# Altium schematic sheet 02 - POWER.SchDoc
size 420 x 297 mm; Organization: ToyBuilder Labs; Address1: 2736 E Walnut St; Address2: Pasadena, California 91107; Address4: +1 (626) 808-4010; DocumentNumber: 3; SheetNumber: 3; SheetTotal: 4
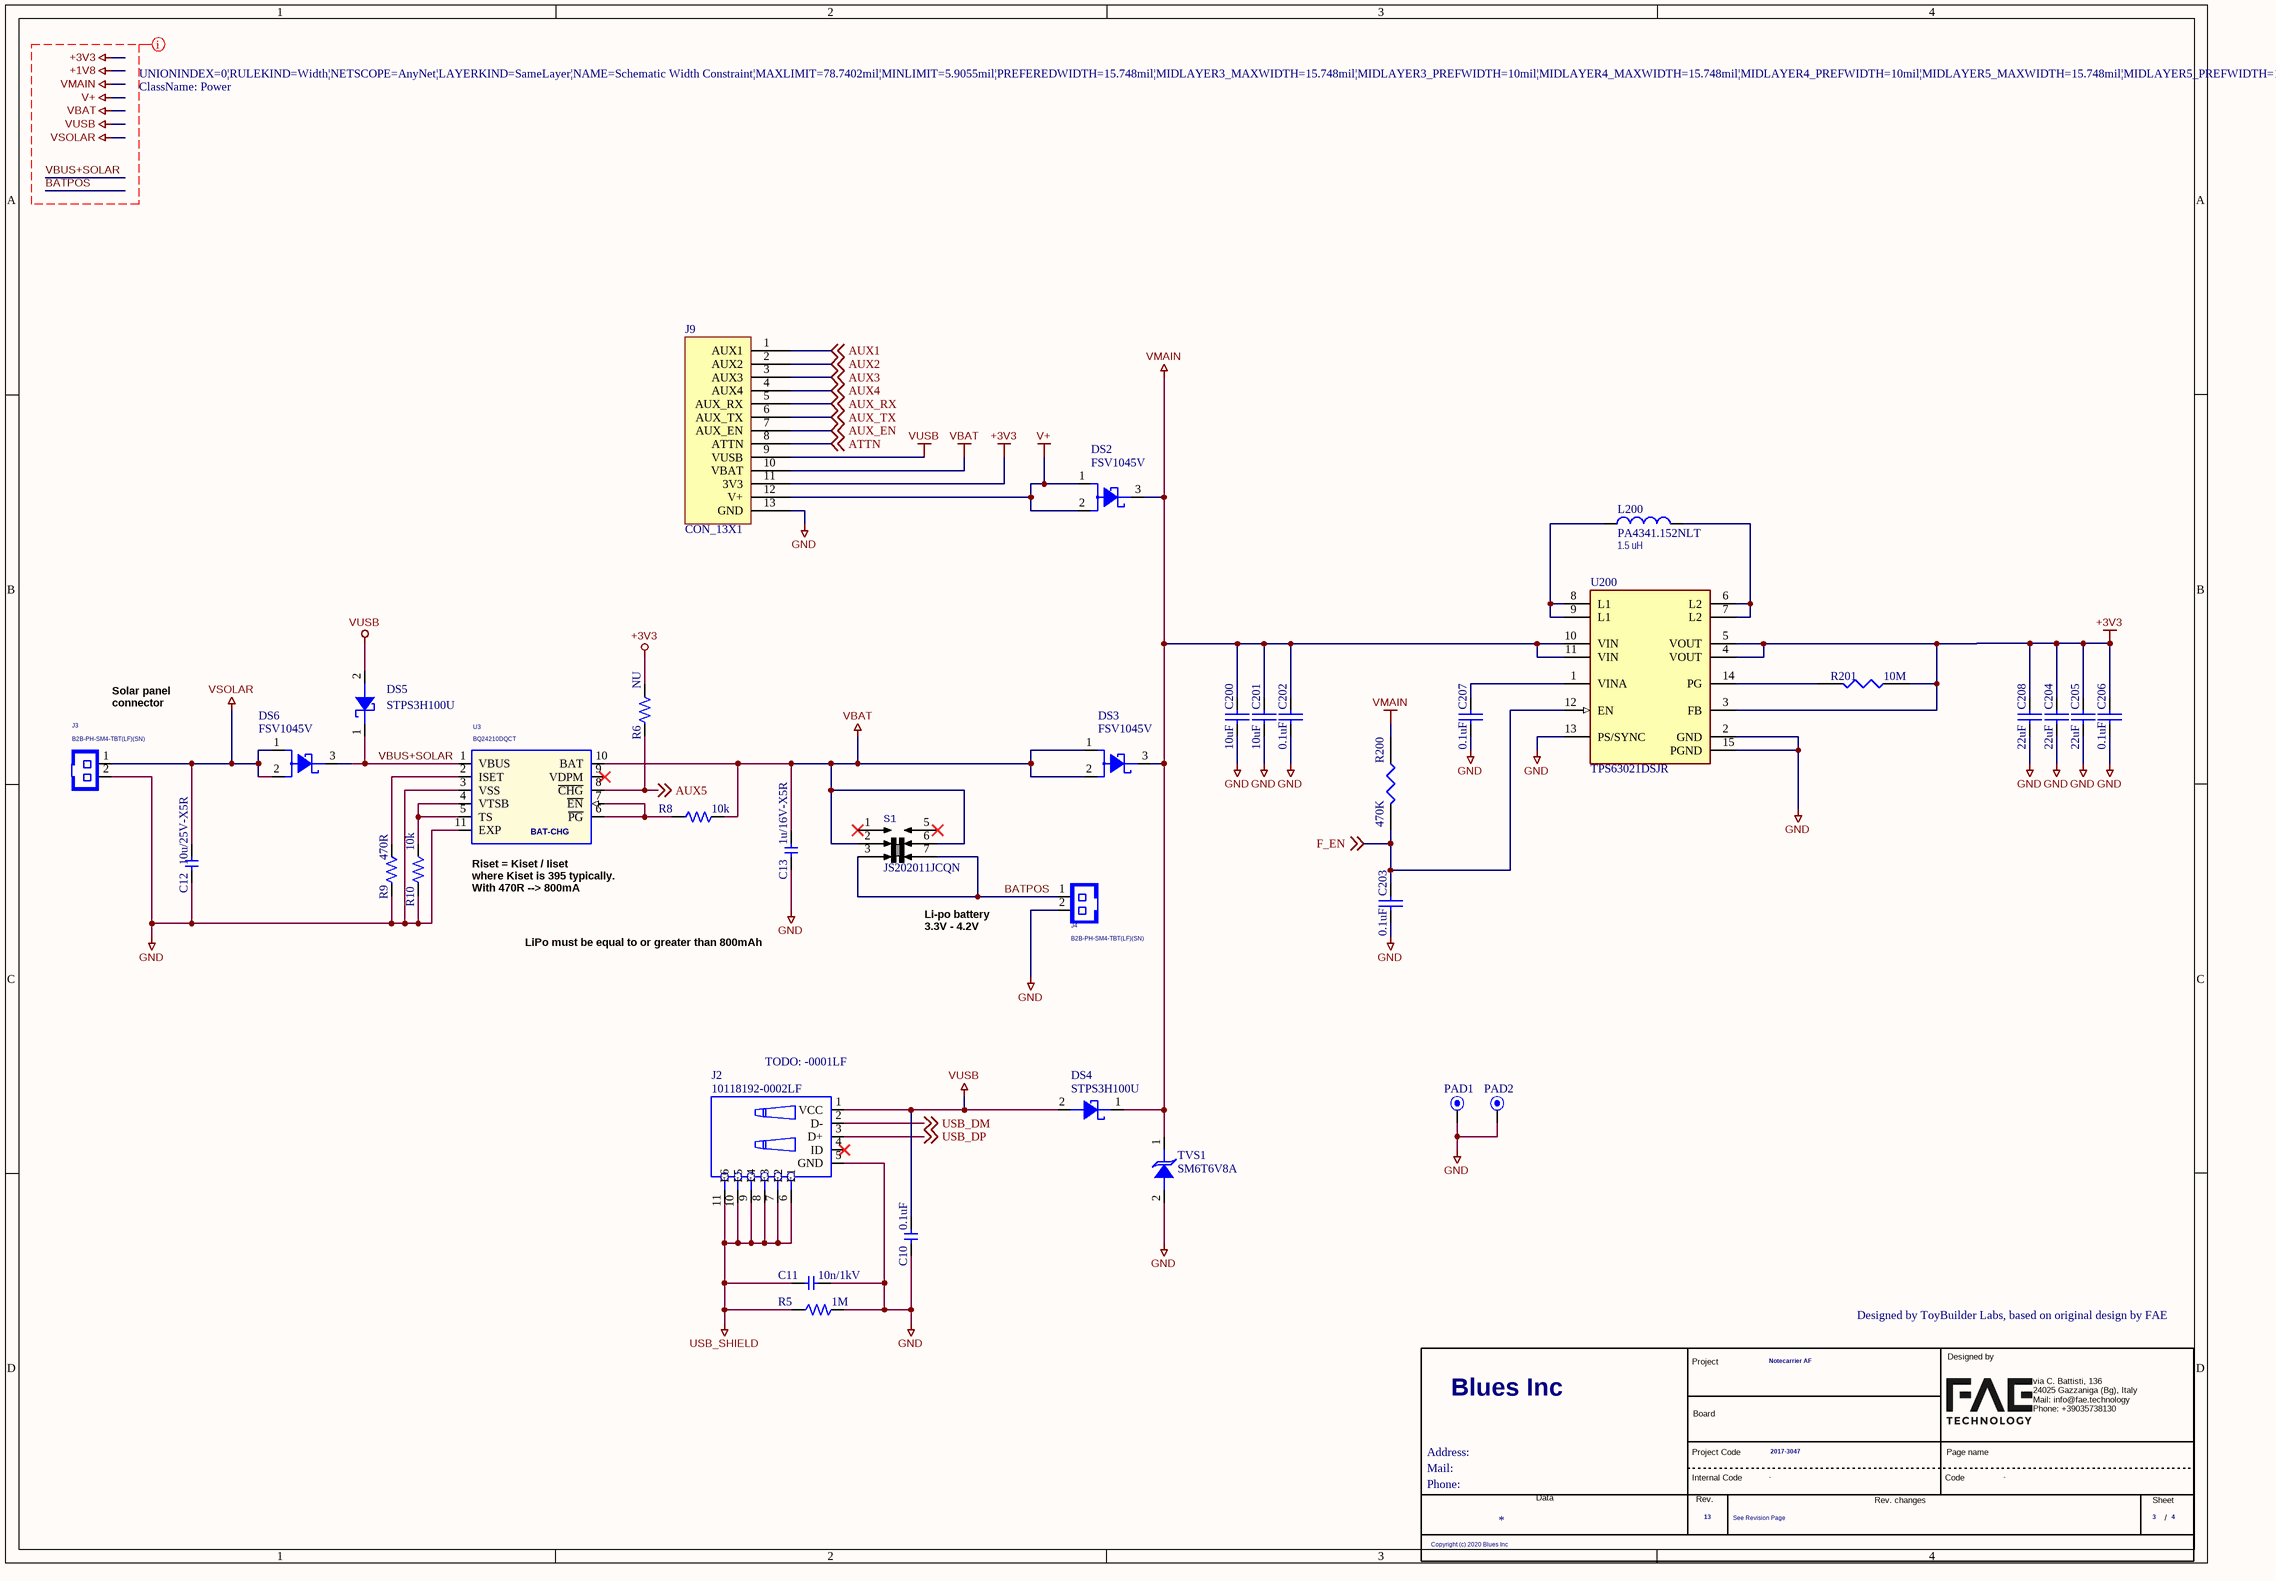
[diagram p0: 02 - POWER.SchDoc]

## Parts
*  Address: Address:  Copyright: Copyright (c) 2020 Blues Inc  CustomerName: Blues Inc  DocumentoRev: See Revision Page  Mail: Mail:  Nome Progetto: Notecarrier AF  Page Count: 4  Page Number: 3  Phone: Phone:  Project Code: 2017-3047  Revision: 13  (hidden comment: MyBlues)  (graphical)
C10  0.1uF  [CS-C-0402]
C11  10n/1kV  [CS-C-1206]
C12  10u/25V-X5R  [CS-C-1206]
C13  1u/16V-X5R  [CS-C-0402]
C200  10uF  [0805_C]
C201  10uF  [0805_C]
C202  0.1uF  [CS-C-0402]
C203  0.1uF  [CS-C-0402]
C204  22uF  [0805_C]
C205  22uF  [0805_C]
C206  0.1uF  [CS-C-0402]
C207  0.1uF  [CS-C-0402]
C208  22uF  [0805_C]
DS2  FSV1045V  [TO277-3]
DS3  FSV1045V  [TO277-3]
DS4  STPS3H100U  [SMB]
DS5  STPS3H100U  [SMB]
DS6  FSV1045V  [TO277-3]
J2  10118192-0002LF  [J-5-0065-FOS-MICROUSB10118192]
J3  B2B-PH-SM4-TBT(LF)(SN)  [J-2-0200-MDS-B2B-PH-SM4]
J4  B2B-PH-SM4-TBT(LF)(SN)  [J-2-0200-MDS-B2B-PH-SM4]
J9  CON_13X1  [WE13S - 2.54]  (no BOM)
L200  PA4341.152NLT  Inductance: 1.5 uH  [PULSE PA4341.XXXNLT]
PAD1  TPS  [PAD-THT-CAS-0100]  (value not drawn)  (no BOM)
PAD2  TPS  [PAD-THT-CAS-0100]  (value not drawn)  (no BOM)
R5  1M  [RS-1206]
R6  NU  [RS-0402]
R8  10k  [RS-0402]
R9  470R  [RS-0402]
R10  10k  [RS-0402]
R200  470K  [RS-0402]
R201  10M  [RS-0402]
S1  JS202011JCQN  [CK_JS202011JCQN]
TVS1  SM6T6V8A  [SMB]
U3  BQ24210DQCT  [WSON10-EXP]
U200  TPS63021DSJR  [FP-DSJ0014A-MFG]

## Nets
+3V3: C204.1 C205.1 C206.1 C208.1 J9.11(3V3) R6.2 R201.1 U200.3(FB) U200.4(VOUT) U200.5(VOUT)
GND: C10.2 C11.2 C12.2 C13.2 C200.2 C201.2 C202.2 C203.2 C204.2 C205.2 C206.2 C207.2 C208.2 J2.5(GND) J3.2 J4.2 J9.13(GND) PAD1.1 PAD2.1 R5.2 R9.1 R10.1 TVS1.2(A) U3.3(VSS) U3.11(EXP) U200.2(GND) U200.13(PS/SYNC) U200.15(PGND)
USB_SHIELD: C11.1 J2.6(E1) J2.7(E2) J2.8(E3) J2.9(E4) J2.10(E5) J2.11(E6) R5.1
V+: DS2.1(A1) DS2.2(A2) J9.12(V+)
VBAT: C13.1 DS3.1(A1) DS3.2(A2) J9.10(VBAT) R8.2 S1.2 S1.6 U3.10(BAT)
VMAIN: C200.1 C201.1 C202.1 DS2.3(C) DS3.3(C) DS4.1(C) R200.1 TVS1.1(C) U200.10(VIN) U200.11(VIN)
VSOLAR: C12.1 DS6.1(A1) DS6.2(A2) J3.1
VUSB: C10.1 DS4.2(A) DS5.2(A) J2.1(VCC) J9.9(VUSB)
ATTN: J9.8(ATTN) ; off-sheet ATTN
AUX1: J9.1(AUX1) ; off-sheet AUX1
AUX2: J9.2(AUX2) ; off-sheet AUX2
AUX3: J9.3(AUX3) ; off-sheet AUX3
AUX4: J9.4(AUX4) ; off-sheet AUX4
AUX5: R6.1 U3.8(~{CHG}) ; off-sheet AUX5
AUX_EN: J9.7(AUX_EN) ; off-sheet AUX_EN
AUX_RX: J9.5(AUX_RX) ; off-sheet AUX_RX
AUX_TX: J9.6(AUX_TX) ; off-sheet AUX_TX
BATPOS: J4.1 S1.3 S1.7
F_EN: C203.1 R200.2 U200.12(EN) ; off-sheet F_EN
USB_DM: J2.2(D-) ; off-sheet USB_DM
USB_DP: J2.3(D+) ; off-sheet USB_DP
VBUS+SOLAR: DS5.1(C) DS6.3(C) U3.1(VBUS)
NetC207_1: C207.1 U200.1(VINA)
NetL200_1: L200.1 U200.8(L1) U200.9(L1)
NetL200_2: L200.2 U200.6(L2) U200.7(L2)
NetR8_1: R8.1 U3.6(~{PG}) U3.7(~{EN})
NetR9_2: R9.2 U3.2(ISET)
NetR10_2: R10.2 U3.4(VTSB) U3.5(TS)
NetR201_2: R201.2 U200.14(PG)

Not connected (* = marked no-connect by the designer): J2 4(ID)*; S1 1* 5*; U3 9(VDPM)*

## Layout directives
rule Width Constraint [Pref Width = 0.4mm    Min Width = 0.15mm    Max Width = 2mm]; net class Power: +1V8, +3V3, BATPOS, V+, VBAT, VBUS+SOLAR, VMAIN, VSOLAR, VUSB

## Notes on the sheet
- (near J3) Solar panel
  connector
- Riset = Kiset / Iiset
  where Kiset is 395 typically.
  With 470R --> 800mA
- LiPo must be equal to or greater than 800mAh
- Li-po battery
  3.3V - 4.2V
- (near J2) TODO: -0001LF
- Designed by ToyBuilder Labs, based on original design by FAE
- Title
- Size:
- Date:
- B
- Number:
- Time:
- Revision:
- Sheet
- of
- File:
- (in symbol BAT-CHARGE - BQ24210DQCT) BAT-CHG
- (in symbol MyBlues) Designed by; Project; Board; via C. Battisti, 136 / 24025 Gazzaniga (Bg), Italy / Mail: info@fae.technology / Phone: +39035738130; Project Code; Page name; Internal Code; Code; Data; Rev.; Rev. changes; Sheet; /

## Library data of the parts
C10 = CS-C-0402-100n/16V: CHIP CAP.CER. 100nF 16V 10% X7R 0402; MFR: Yageo; Database: 22452; Famiglia: CONDENSATORE; Modello: CERAMICO; Pkg Type: SMD; D: Multilayer Ceramic Capacitors MLCC - SMD/SMT 0.1 uF 16V 10% Ceramic Capacitor; PN: CC0402KPX5R7BB104; Caratteristiche: X7R; Distributor: FAE; Price Distributor Cad: 0,0021; PCB Footprint: CS-C-0402
C11 = CS-C-1206-10n/1kV: CHIP CAP.CER. 10nF 1000V 10% X7R 1206; Database: 28470; Famiglia: CONDENSATORE; Modello: CERAMICO; Pkg Type: SMD; Caratteristiche: X7R; Distributor: FAE; Price Distributor Cad: 0,035; PCB Footprint: CS-C-1206
C12 = CS-C-1206-10u/25V-X5R: CHIP CAP.CER. 10uF 25V X5R 10% 1206; Pkg Type: SMD; Modello: CERAMICO; Famiglia: CONDENSATORE; Database: 21513; Price Distributor Cad: 0,0195; Distributor: FAE; Caratteristiche: X5R; PCB Footprint: CS-C-1206
C13 = CS-C-0402-1u/16-X5R: CHIP CAP.CER. 1uF 16V 10% X5R 0402; Pkg Type: SMD; Modello: CERAMICO; Famiglia: CONDENSATORE; Database: 37485; Price Distributor Cad: 0,0253; Distributor: FAE; Caratteristiche: X5R; PCB Footprint: CS-C-0402
C200 = CAP: CHIP CAP.CER. 10uF 16V 10% X7R 0805; MFR: TDK; PN: C2012JB1C106K085AC; D: Multilayer Ceramic Capacitors MLCC - SMD/SMT 0805 16V 10uF JB 10% T: 0.85mm
C201 = CAP: CHIP CAP.CER. 10uF 16V 10% X7R 0805; MFR: TDK; D: Multilayer Ceramic Capacitors MLCC - SMD/SMT 0805 16V 10uF JB 10% T: 0.85mm; PN: C2012JB1C106K085AC
C202 = CAP: CHIP CAP.CER. 100nF 16V 10% X7R 0402; MFR: Yageo; D: Multilayer Ceramic Capacitors MLCC - SMD/SMT 0.1 uF 16V 10% Ceramic Capacitor; PN: CC0402KPX5R7BB104
C203 C206 C207 = CAP: CHIP CAP.CER. 100nF 16V 10% X7R 0402; MFR: Yageo; PN: CC0402KPX5R7BB104; D: Multilayer Ceramic Capacitors MLCC - SMD/SMT 0.1 uF 16V 10% Ceramic Capacitor
C204 C208 = CAP: CHIP CAP.CER. 22uF 16V 10% X7R 0805; MFR: TDK; D: Multilayer Ceramic Capacitors MLCC - SMD/SMT 0805 16V 22uF JB 10% T: 0.85mm; PN: C2012JB1C226K085AC
C205 = CAP: CHIP CAP.CER. 22uF 16V 10% X7R 0805; MFR: TDK; PN: C2012JB1C226K085AC; D: Multilayer Ceramic Capacitors MLCC - SMD/SMT 0805 16V 22uF JB 10% T: 0.85mm
DS2 DS3 DS6 = SCHOTTKY - FSV1045V - 10A/45V: DIODO SCHOTTKY 10A 45V FSV1045V TO277-3 SMT; Database: 42269; Pkg Type: SMD; Temp Range: -55°..+150°; Caratteristiche: 10A/45V; Distributor: FAE; Famiglia: DIODO; Modello: SCHOTTKY; Price Distributor Cad: 0,629; MPN: FSV1045V; PCB Footprint: TO277-3
DS4 = SCHOTTKY-STPS3H100U - 3A/100V: DIODO SCHOTTKY 3A 100V STPS3H100U SMB SMT; Database: 40665; Pkg Type: SMD; ROOM: USB; Caratteristiche: 3A/100V; Distributor: FAE; Famiglia: DIODO; Modello: SCHOTTKY; Price Distributor Cad: 0,336; MPN: STPS3H100U; PCB Footprint: SMB
DS5 = SCHOTTKY-STPS3H100U - 3A/100V: DIODO SCHOTTKY 3A 100V STPS3H100U SMB SMT; Database: 40665; Pkg Type: SMD; ROOM: SOLAR BATTERY CHARGER; Caratteristiche: 3A/100V; Distributor: FAE; Famiglia: DIODO; Modello: SCHOTTKY; Price Distributor Cad: 0,336; MPN: STPS3H100U; PCB Footprint: SMB
J2 = USB - uUSB-B-10118192-0002LF: CONN. USB F/90° TIPO MICRO-B C.S. 10118192-0002LF FCI SMT; Famiglia: CONNETTORE; Modello: MICROUSB; Note: Full SMD, no FLANGE; Pkg Type: SMD; Temp Range: -30°..+80°; PCB Footprint: J-5-0065-FOS-USB10118192-NOF; Distributor: D-609-5379-1-ND; MPN: 10118192-0002LF; Price Distributor Cad: 0,42
J3 J4 = PH - J-2-0200-MDS-B2B-PH-SM4: CONN. PH 2P M/D P=2 B2B-PH-SM4-TBT(LF)(SN) JST SMT; Temp Range: -25°..+85°; Pkg Type: SMD; Note: 100V - 2A - AWG32 to AWG24; Famiglia: CONNETTORE; Database: 36983; MPN: B2B-PH-SM4-TBT(LF)(SN); Price Distributor Cad: 0,347; Modello: PH; Distributor: FAE; Caratteristiche: 2P; PCB Footprint: J-2-0200-MDS-B2B-PH-SM4
J9 = CON_13X1: PN: DNM
L200 = PA4341.152NLT: 1.5uH, 9A SMD, (7.6 x 6.9 mm, 3.0 mm highi) 15 mOhm; Manufacturer: Pulse; Description 1: FIXED IND 1.5UH 9A 15 MOHM SMD; DC Resistance: 15 mOhm; Supplier 1: Digi-Key; Supplier Part Number 1: 553-3403-1-ND; Manufacturer Part Number: PA4341.152NLT; RoHS: No; Category: Fixed Inductors; Stock 1: 3652; Pricing 1: 1=1.04000, 10=0.96500, 25=0.89040, 50=0.74200, 100=0.69750, 250=0.62328, 500=0.53424 (USD); ComponentLink1URL: http://productfinder.pulseeng.com/products/datasheets/P768.pdf?src-supplier=Digi-Key; ComponentLink1Description: http://productfinder.pulseeng.com/products/datasheets/P768.pdf?src-supplier=Digi-Key; Current Rating: 9 A; Dimension: 7.60 mm x 6.90 mm; Height: 3.00 mm
PAD1 PAD2 = CASTELLATED PAD - 0100: Mounting Pads; Pkg Type: THT; Distributor: FAE; PCB Footprint: PAD-THT-CAS-0100
R5 = RS-1206-1M: CHIP RES. 1M 1206 1/4W 1%; Database: 39104; Pkg Type: SMD; Modello: FISSO; Famiglia: RESISTENZA; ROOM: USB; Price Distributor Cad: 0,0011; Distributor: FAE; Caratteristiche: 1%; PCB Footprint: RS-1206
R6 R8 R10 = RS-0402-10k: CHIP RES. 10K 0402 1/16W 1%; Pkg Type: SMD; Temp Range: -55°..+125°; Database: 25129; Famiglia: RESISTENZA; Modello: FISSO; Distributor: FAE; Price Distributor Cad: 0,0007; Caratteristiche: 1%; PCB Footprint: RS-0402
R9 = RS-0402-470r: CHIP RES. 470R 0402 1/16W 1%; Database: 25128; Pkg Type: SMD; Famiglia: RESISTENZA; Modello: FISSO; Price Distributor Cad: 0,0006; Distributor: FAE; Caratteristiche: 1%; PCB Footprint: RS-0402
R200 = R1_S: CHIP RES. 470K 0402 1/16W 1%; MFR: Vishay / Dale; PN: CRCW0402470KFKEDC; D: Thick Film Resistors 1/16watt 470Kohms 1% Commercial Use; Supplier 1: Digi-Key; Supplier Part Number 1: 541-470KLCT-ND
R201 = R1_S: CHIP RES. 10M 0402 1/16W 1%; MFR: Vishay / Dale; PN: CRCW040210M0FKEDC; D: Thick Film Resistors 1/16watt 10Mohms 1% Commercial Use
S1 = CK_JS202011JCQN: SWITCH SLIDE DPDT 300MA 6V, SMD, J-lead; Manufacturer: ITT C&K; Actuator Material: Nylon,Polyamide; Contact Resistance: 70mR; Electrical Life: 5000Cycles; Switch Travel: 2mm; Switch Function: On-On; Actuator Type: Standard; Supplier 1: Digi-Key; Manufacturer Part Number: JS202011JCQN; RoHS: Yes; Category: Slide Switches; Stock 1: 50096; Pricing 1: 1=0.48000, 10=0.46300, 25=0.45320, 50=0.40500, 100=0.38580, 250=0.37612, 500=0.31826 (USD); Mount: Surface Mount; Contact Material: Copper Alloy; Contact Plating: Silver; Housing Material: Nylon; Min Operating Temperature: -20°C; Max Operating Temperature: 85°C; Throw Configuration: DPDT; Max Voltage Rating (DC): 6V; Termination: Gull Wing; Voltage Rating (DC): 6V; Packaging: Tape and Reel; Max Current Rating: 300mA; Contact Current Rating: 300mA; Package Quantity: 1; Current Rating: 300mA; Orientation: Vertical; Length: 9mm; Depth: 7.5mm; Actuator Length: 2mm; Radiation Hardening: No; REACH SVHC: No SVHC; Lead Free: Lead Free; Flammability Rating: UL94 V-2; ComponentLink1URL: https://datasheet.ciiva.com/23829/1707718-23829488.pdf?src-supplier=Newark; ComponentLink1Description: https://datasheet.ciiva.com/23829/1707718-23829488.pdf?src-supplier=Newark; ComponentLink2URL: https://datasheet.ciiva.com/2889/js-29aug13-2889127.pdf?src-supplier=Digi-Key; ComponentLink2Description: https://datasheet.ciiva.com/2889/js-29aug13-2889127.pdf?src-supplier=Digi-Key; ComponentLink3URL: https://datasheet.ciiva.com/2889/js-15sept15-2889128.pdf?src-supplier=Digi-Key; ComponentLink3Description: https://datasheet.ciiva.com/2889/js-15sept15-2889128.pdf?src-supplier=Digi-Key; ComponentLink4URL: https://datasheet.ciiva.com/2889/js-15sept15-2889129.pdf?src-supplier=Digi-Key; ComponentLink4Description: https://datasheet.ciiva.com/2889/js-15sept15-2889129.pdf?src-supplier=Digi-Key; ComponentLink5URL: https://datasheet.ciiva.com/22630/1707718-22630697.pdf?src-supplier=Element14; ComponentLink5Description: https://datasheet.ciiva.com/22630/1707718-22630697.pdf?src-supplier=Element14; ComponentLink6URL: https://datasheet.ciiva.com/8625/js-9dec14-8625470.pdf?src-supplier=Avnet; ComponentLink6Description: https://datasheet.ciiva.com/8625/js-9dec14-8625470.pdf?src-supplier=Avnet; Supplier Part Number 1: 401-2002-1-ND
TVS1 = TVS-UNI - SM6T6V8A - 6.8V/600W: DIODO TVS TRANSIL UNIDIR. 600W 6.8V SM6T6V8A SMB SMT; Pkg Type: SMD; Database: 14165; Note: Unidirezionale; Caratteristiche: 57A/6.8V/600W; Famiglia: PROTEZIONE; ROOM: INPUT; Distributor: FAE; Price Distributor Cad: 0,0348; Modello: TVS; PCB Footprint: SMB
U3 = BAT-CHARGE - BQ24210DQCT: INTEGRATO BQ24210DQCT TEXAS WSON10 SMT; Temp Range: -40°..+85°; Pkg Type: SMD; Note: Vin=20V - Ichg=800mA; Modello: CARICABATTERIA; Caratteristiche: LITIO; ROOM: SOLAR BATTERY CHARGER; Price Distributor Cad: 2,72; MPN: BQ24210DQCT; Famiglia: INTEGRATO; Distributor: D-296-28738-1-ND; PCB Footprint: WSON10-EXP
U200 = CMP-04918-000102-1: IC REG BCK BST 3.3V 3.5A 14VSON; Manufacturer: Texas Instruments; Max Junction Temp: +125°C; Output Current: 2A; Switching Topology: Buck-Boost; Min Supply Voltage: 1.8V; Standoff Height: 0mm; Switching Frequency: 2400kHz; Output Type: AdjustableProgrammable; Max Supply Voltage: 5.5V; Output Voltage: 1.2-5.5V; Max Duty Cycle: 100%; Number Of Outputs: 1; Nominal Supply Current: 25uA; Mouser Description: Conv DC-DC 1.8V to 5.5V Non-Inv/Inv/Step Up/Step Down Single-Out 3.3V 3A 14-Pin VSON EP T/R; Octopart: https://octopart.com/tps63021dsjr-texas+instruments-17659431; Temperature: -40°C to +85°C; RoHS: TRUE; Package: DSJ0014A; Device Class L3: Voltage Regulators - Switching; Height: 1mm; Ambient Temperature Range Low: -40°C; Device Class L2: Power Management ICs; Temperature Range High: +85°C; ComponentLink2URL: http://www.ti.com/lit/ds/symlink/tps63021.pdf; Device Class L1: Integrated Circuits (ICs); ComponentLink2Description: Datasheet; Automotive: No; Manufacturer Part Number: TPS63021DSJR; Lead Free: Yes; Digikey Description: IC REG BCK BST 3.3V 3.5A 14VSON; Temperature Range Low: -40°C; Category: IC; Ambient Temperature Range High: +85°C
* = MyBlues: Customer Code: -; Database: -; Page Modify Date: *; Customer name: Blues Inc; FAE RD code: 2017-3047